# EAGLE schematic rectificador (EAGLE 9.6.2)
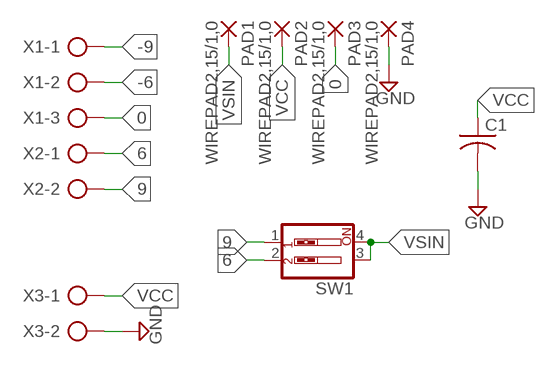
[diagram p0: schematic, sheet 1]

## Parts
C1  C-US050-024X044  [C050-024X044]
PAD1  WIREPAD2,15/1,0  [2,15/1,0]
PAD2  WIREPAD2,15/1,0  [2,15/1,0]
PAD3  WIREPAD2,15/1,0  [2,15/1,0]
PAD4  WIREPAD2,15/1,0  [2,15/1,0]
SW1  SW_DIP-2  [EDG-02]
X1  AK300/3  [AK300/3]
X2  AK300/2  [AK300/2]
X3  AK300/2  [AK300/2]

## Nets
0: PAD3.1(P) X1.3
6: SW1.2 X2.1
9: SW1.1 X2.2
-6: X1.2
-9: X1.1
GND: C1.2 PAD4.1(P) X3.2
VCC: C1.1 PAD2.1(P) X3.1
VSIN: PAD1.1(P) SW1.3 SW1.4

## Library data of the parts
C1 = rcl:C-US: CAPACITOR, American symbol; SPICEPREFIX: C
PAD1-PAD4 = wirepad:WIREPAD: Wire PAD connect wire on PCB
SW1 = special:SW_DIP-2: DIP SWITCH
X1 = con-ptr500:AK300/3: CONNECTOR; OC_FARNELL: unknown; OC_NEWARK: unknown
X2 X3 = con-ptr500:AK300/2: CONNECTOR; OC_FARNELL: unknown; OC_NEWARK: unknown